# EAGLE schematic mono main V2-5 (EAGLE 7.4.0)
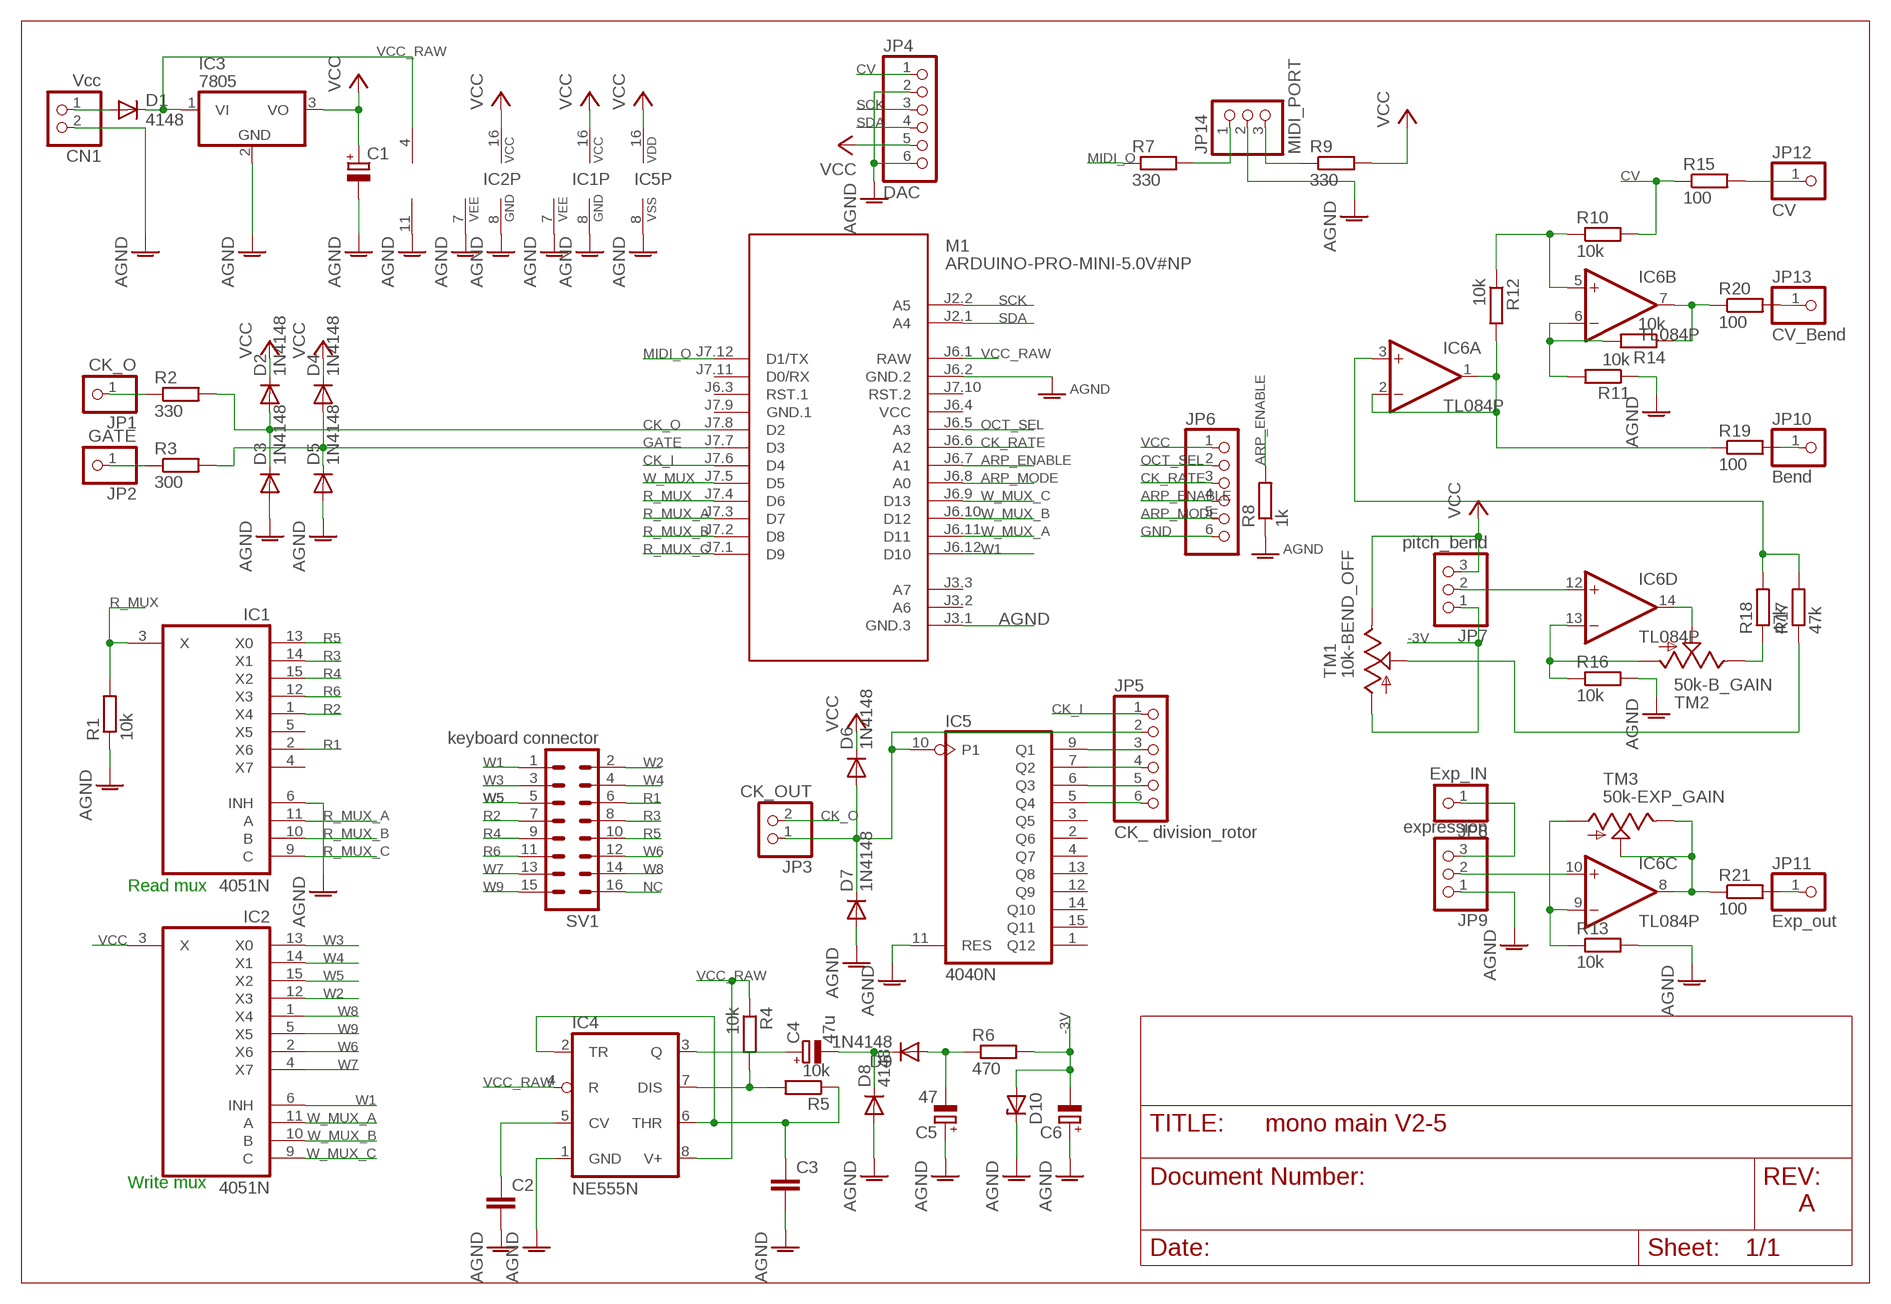
[diagram p0: schematic, sheet 1]

## Parts
C1  CPOL-EUE5-8.5  [E5-8,5]
C2  C-EU050-030X075  [C050-030X075]
C3  C-EU050-030X075  [C050-030X075]
C4  47u  CPOL-EUE5-8.5  [E5-8,5]
C5  47  CPOL-EUE5-8.5  [E5-8,5]
C6  CPOL-EUE5-8.5  [E5-8,5]
CN1  Vcc  JST_2PIN-THM  [JST-PH-2-THM]
D1  4148  DIODE-D-2.5  [D-2.5]
D2  1N4148  DIODE-D-2.5  [D-2.5]
D3  1N4148  DIODE-D-2.5  [D-2.5]
D4  1N4148  1N4148DO35-7  [DO35-7]
D5  1N4148  1N4148DO35-7  [DO35-7]
D6  1N4148  DIODE-D-2.5  [D-2.5]
D7  1N4148  DIODE-D-2.5  [D-2.5]
D8  4148  DIODE-D-2.5  [D-2.5]
D9  1N4148  DIODE-D-2.5  [D-2.5]
D10  ZENER-DIODEZD-7.5  [ZDIO-7.5]
IC1  4051N  [DIL16]
IC2  4051N  [DIL16]
IC3  7805  7805TV  [TO220V]
IC4  NE555N  [DIL08-ROUND]
IC5  4040N  [DIL16]
IC6  TL084P  [DIL14]
JP1  CK_O  PINHD-1X1  [1X01]
JP2  GATE  PINHD-1X1  [1X01]
JP3  CK_OUT  PINHD-1X2  [1X02]
JP4  DAC  PINHD-1X6  [1X06]
JP5  CK_ division_rotor  PINHD-1X6  [1X06]
JP6  PINHD-1X6  [1X06]
JP7  pitch_bend  PINHD-1X3  [1X03]
JP8  Exp_IN  PINHD-1X1  [1X01]
JP9  expression  PINHD-1X3  [1X03]
JP10  Bend  PINHD-1X1  [1X01]
JP11  Exp_out  PINHD-1X1  [1X01]
JP12  CV  PINHD-1X1  [1X01]
JP13  CV_Bend  PINHD-1X1  [1X01]
JP14  MIDI_PORT  PINHD-1X3  [1X03]
M1  ARDUINO-PRO-MINI-5.0V#NP  [ARDUINO-PRO-MINI#NP]
R1  10k  R-EU_0204/7  [0204/7]
R2  330  R-EU_0204/2V  [0204V]
R3  300  R-EU_0204/2V  [0204V]
R4  10k  R-EU_0204/2V  [0204V]
R5  10k  R-EU_0204/2V  [0204V]
R6  470  R-EU_0204/2V  [0204V]
R7  330  R-EU_0204/2V  [0204V]
R8  1k  R-EU_0204/7  [0204/7]
R9  330  R-EU_0204/2V  [0204V]
R10  10k  R-EU_0204/2V  [0204V]
R11  10k  R-EU_0204/2V  [0204V]
R12  10k  R0204/7  [0204/7]
R13  10k  R-EU_0204/2V  [0204V]
R14  10k  R-EU_0204/2V  [0204V]
R15  100  R-EU_0204/2V  [0204V]
R16  10k  R-EU_0204/2V  [0204V]
R17  47k  R-EU_0204/2V  [0204V]
R18  47k  R-EU_0204/7  [0204/7]
R19  100  R-EU_0204/2V  [0204V]
R20  100  R-EU_0204/2V  [0204V]
R21  100  R-EU_0204/2V  [0204V]
SV1  keyboard connector  MA08-2  [MA08-2]
TM1  10k-BEND_OFF  TRIM  [6MM]
TM2  50k-B_GAIN  TRIM  [6MM]
TM3  50k-EXP_GAIN  TRIM  [6MM]

## Nets
-3V: C6.- D10.A JP7.1 R6.2 TM1.A
AGND: C1.- C2.2 C3.2 C5.+ C6.+ CN1.2 D3.A D5.A D7.A D8.A D10.C IC1.6(INH) IC1.7(VEE) IC1.8(GND) IC2.7(VEE) IC2.8(GND) IC3.2(GND) IC4.1(GND) IC5.8(VSS) IC5.11(RES) IC6.11(P:V-) JP4.2 JP4.6 JP9.1 JP14.2 M1.J3.1(GND.3) M1.J6.2(GND.2) R1.1 R8.1 R11.1 R13.2 R16.2
ARP_ENABLE: JP6.4 M1.J6.7(A1) R8.2
ARP_MODE: JP6.5 M1.J6.8(A0)
CK_I: JP5.1 M1.J7.6(D4)
CK_O: D2.A D3.C JP3.2 M1.J7.8(D2) R2.2
CK_RATE: JP6.3 M1.J6.6(A2)
CV: JP4.1 R10.2 R15.1
GATE: D4.A D5.C M1.J7.7(D3) R3.2
GND: JP6.6
MIDI_O: M1.J7.12(D1/TX) R7.1
N$1: IC6.14(D:OUT) TM2.S
N$2: R17.1 TM1.S
N$3: R18.1 TM2.E
N$4: IC6.3(A:+IN) R17.2 R18.2
N$5: IC6.1(A:OUT) IC6.2(A:-IN) R12.2 R19.1
N$6: JP10.1 R19.2
N$7: JP13.1 R20.2
N$8: JP11.1 R21.2
N$15: JP12.1 R15.2
N$16: JP1.1 R2.1
N$22: IC5.9(Q1) JP5.3
N$23: IC5.7(Q2) JP5.4
N$24: IC5.6(Q3) JP5.5
N$25: IC5.5(Q4) JP5.6
N$26: D6.A D7.C IC5.10(P1) JP3.1 JP5.2
N$28: JP2.1 R3.1
N$30: JP14.1 R7.2
N$31: JP14.3 R9.1
N$33: IC6.9(C:-IN) R13.1 TM3.A
N$40: IC4.7(DIS) R4.2 R5.2
N$41: C3.1 IC4.2(TR) IC4.6(THR) R5.1
N$42: C2.1 IC4.5(CV)
N$44: C4.+ IC4.3(Q)
N$45: C4.- D8.C D9.C
N$46: C5.- D9.A R6.1
N$48: IC6.12(D:+IN) JP7.2
N$49: IC6.13(D:-IN) R16.1 TM2.A
N$51: IC6.10(C:+IN) JP9.2
N$52: IC6.8(C:OUT) R21.1 TM3.E TM3.S
N$53: CN1.1 D1.A
N$55: IC6.6(B:-IN) R11.2 R14.2
N$56: IC6.7(B:OUT) R14.1 R20.1
N$60: IC6.5(B:+IN) R10.1 R12.1
N$61: JP8.1 JP9.3
NC: SV1.16
OCT_SEL: JP6.2 M1.J6.5(A3)
R1: IC1.2(X6) SV1.6
R2: IC1.1(X4) SV1.7
R3: IC1.14(X1) SV1.8
R4: IC1.15(X2) SV1.9
R5: IC1.13(X0) SV1.10
R6: IC1.12(X3) SV1.11
R_MUX: IC1.3(X) M1.J7.4(D6) R1.2
R_MUX_A: IC1.11(A) M1.J7.3(D7)
R_MUX_B: IC1.10(B) M1.J7.2(D8)
R_MUX_C: IC1.9(C) M1.J7.1(D9)
SCK: JP4.3 M1.J2.2(A5)
SDA: JP4.4 M1.J2.1(A4)
VCC: C1.+ D2.C D4.C D6.C IC1.16(VCC) IC2.3(X) IC3.3(VO) IC5.16(VDD) JP4.5 JP6.1 JP7.3 R9.2 TM1.E
VCC_RAW: D1.C IC3.1(VI) IC4.4(R) IC4.8(V+) IC6.4(P:V+) M1.J6.1(RAW) R4.1
W1: IC2.6(INH) M1.J6.12(D10) SV1.1
W2: IC2.12(X3) SV1.2
W3: IC2.13(X0) SV1.3
W4: IC2.14(X1) SV1.4
W5: IC2.15(X2) SV1.5
W6: IC2.2(X6) SV1.12
W7: IC2.4(X7) SV1.13
W8: IC2.1(X4) SV1.14
W9: IC2.5(X5) SV1.15
W_MUX: M1.J7.5(D5)
W_MUX_A: IC2.11(A) M1.J6.11(D11)
W_MUX_B: IC2.10(B) M1.J6.10(D12)
W_MUX_C: IC2.9(C) M1.J6.9(D13)
Unconnected: IC1.4(X7) IC1.5(X5) IC5.1(Q12) IC5.2(Q6) IC5.3(Q5) IC5.4(Q7) IC5.12(Q9) IC5.13(Q8) IC5.14(Q10) IC5.15(Q11) M1.J3.2(A6) M1.J3.3(A7) M1.J6.3(RST.1) M1.J7.10(RST.2) M1.J7.11(D0/RX)

## Notes on the sheet
- Read mux
- Write mux
- A

## Power pins joined to a net without a drawn wire
GND.1: M1.J7.9(GND.1)
VCC: IC2.16(VCC) M1.J6.4(VCC)

## Library data of the parts
C1 C4-C6 = rcl:CPOL-EU: POLARIZED CAPACITOR, European symbol
C2 C3 = rcl:C-EU: CAPACITOR, European symbol
CN1 = adafruit:JST_2PIN: JST 2-Pin Connectors of various flavors SMT-RA (S2B-PH-SM4) 4UConnector #17311 SMT (B2B-PH-SM4) THM-RA (S2B-PH) THM (B2B-PH)
D1-D3 D6-D9 = diode:DIODE-: DIODE
D4 D5 = diode:1N4148: DIODE high speed (Philips)
D10 = diode:ZENER-DIODE: Z-Diode
IC1 IC2 = 40xx:4051: 8-channel ANALOG MULTIPLEXER
IC3 = linear:78*: Positive VOLTAGE REGULATOR Source: http://cache.national.com/ds/LM/LM78L05.pdf http://www.fairchildsemi.com/ds/LM/LM7805.pdf
IC4 = adafruit:*555: TIMER Changed DIP package to have round (not oval) pin pads http://www.ladyada.net/library/pcb/eaglelibrary.html
IC5 = 40xx:4040: 12-stage binary/ripple COUNTER
IC6 = linear:TL084: OP AMP
JP1 JP2 JP8 JP10-JP13 = adafruit:PINHD-1X1: Pin header 1x1 for 0.1" spacing With round pins
JP3 = pinhead:PINHD-1X2: PIN HEADER
JP4 = adafruit:PINHD-1X6: PIN HEADER
JP5 JP6 = pinhead:PINHD-1X6: PIN HEADER
JP7 JP9 JP14 = adafruit:PINHD-1X3: PIN HEADER
M1 = diy-modules:ARDUINO-PRO-MINI-*#NP: Arduino Pro Mini (and compatible devices) without programming pads More details available here: https://www.arduino.cc/en/Main/ArduinoBoardProMini Click here to find device on ebay.com <http://www.ebay.com/sch/arduino+pro+mini>
R1-R11 R13-R21 = rcl:R-EU_: RESISTOR, European symbol
R12 = eagle-ltspice:R: RESISTOR, European symbol; SPICEMODEL: NONE; SPICEPREFIX: R
SV1 = con-lstb:MA08-2: PIN HEADER; OC_FARNELL: unknown; OC_NEWARK: unknown
TM1-TM3 = adafruit:TRIM